# Altium schematic sheet Fri3D_2020_Power.SchDoc: Power
size A3; Date: 06/06/2022; DrawnBy: Wim Van Gool; DocumentNumber: 4; Revision: 03; SheetNumber: 4; SheetTotal: 4
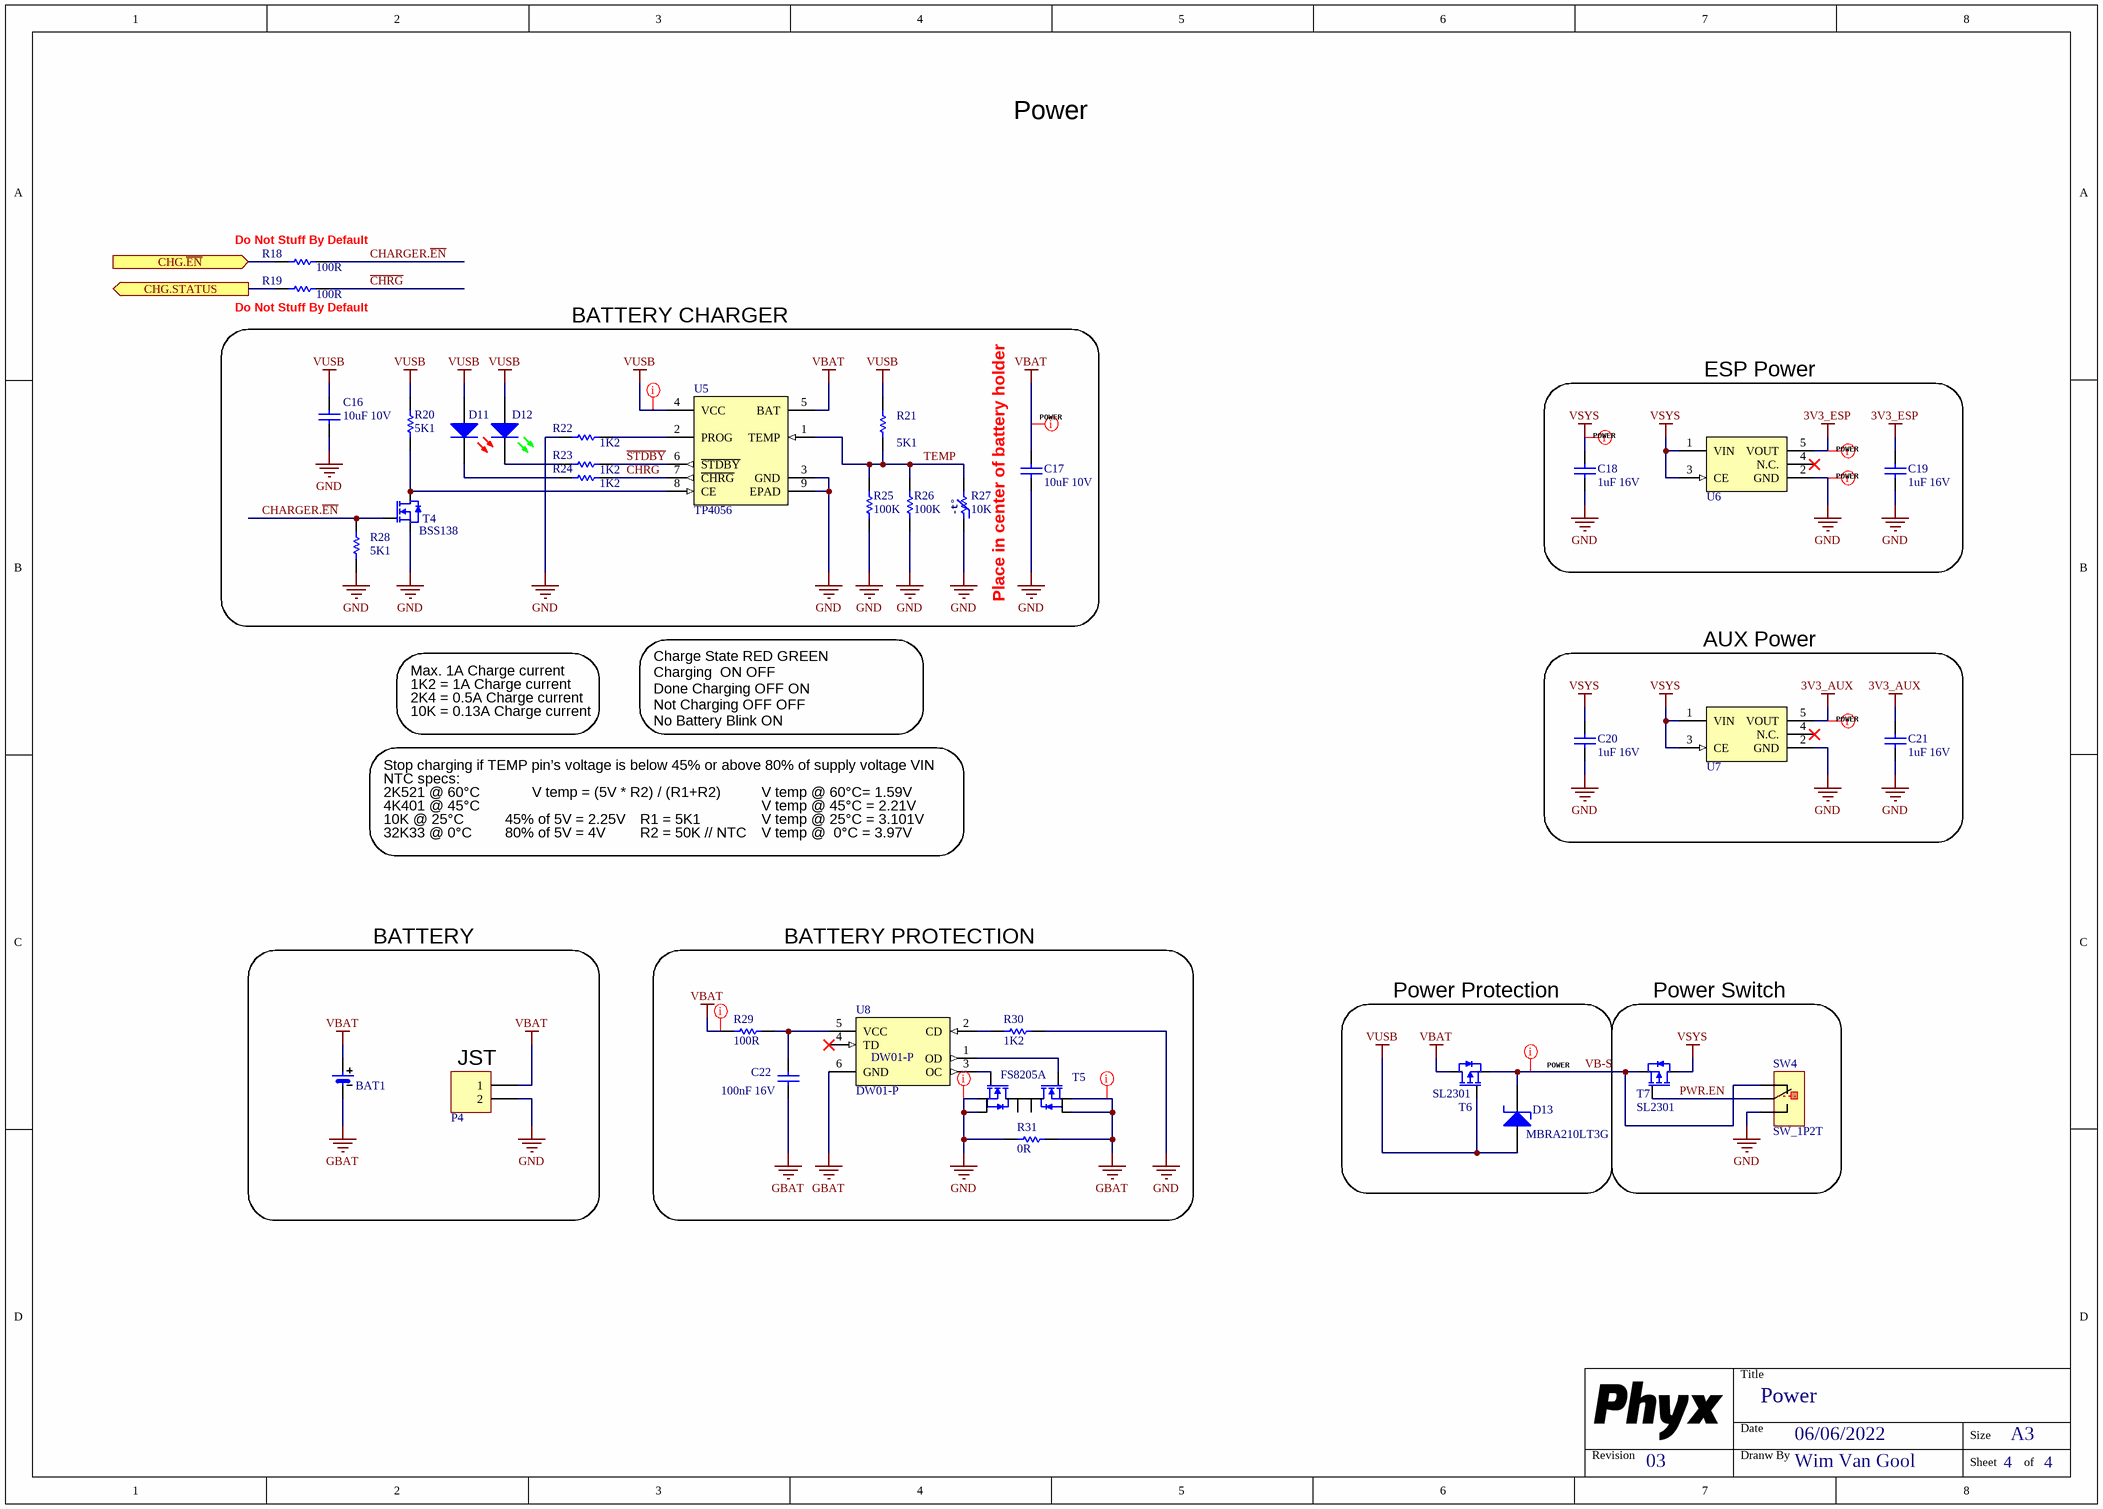
[diagram p0: Fri3D_2020_Power.SchDoc]

## Parts
BAT1  18650 Battery holder with spring  [BAT_18650_SPRING]  (value not drawn)
C16  value 10uF 10V  [C0805_N]  (hidden comment: CAP_CERAMIC)
C17  value 10uF 10V  [C0805_N]  (hidden comment: CAP_CERAMIC)
C18  value 1uF 16V  [C0603_N]  (hidden comment: CAP_CERAMIC)
C19  value 1uF 16V  [C0603_N]  (hidden comment: CAP_CERAMIC)
C20  value 1uF 16V  [C0603_N]  (hidden comment: CAP_CERAMIC)
C21  value 1uF 16V  [C0603_N]  (hidden comment: CAP_CERAMIC)
C22  value 100nF 16V  [C0603_N]
D11  Default 0805 Red LED  [LED_0805_RD]  (value not drawn)
D12  Default 0805 Green LED  [LED_0805_GR]  (value not drawn)
D13  MBRA210LT3G  [SMA_AC]
P4  Header 2.0mm Shrouded 2  [WE_620102131822]  (value not drawn)
R18  value 100R  [R0603_N]  (hidden comment: RESISTOR)
R19  value 100R  [R0603_N]  (hidden comment: RESISTOR)
R20  value 5K1  [R0603_N]  (hidden comment: RESISTOR)
R21  value 5K1  [R0603_N]  (hidden comment: RESISTOR)
R22  value 1K2  [R0603_N]  (hidden comment: RESISTOR)
R23  value 1K2  [R0603_N]  (hidden comment: RESISTOR)
R24  value 1K2  [R0603_N]  (hidden comment: RESISTOR)
R25  value 100K  [R0603_N]  (hidden comment: RESISTOR)
R26  value 100K  [R0603_N]  (hidden comment: RESISTOR)
R27  value 10K  [R0402]  (hidden comment: NTC)
R28  value 5K1  [R0603_N]  (hidden comment: RESISTOR)
R29  value 100R  [R0603_N]  (hidden comment: RESISTOR)
R30  value 1K2  [R0603_N]  (hidden comment: RESISTOR)
R31  value 0R  [R0603_N]
SW4  SW_1P2T  [WE_450404015514]
T4  value BSS138  [SOT23-3]  (hidden comment: 0.2A N-Ch MOSFET Vgs 3.2)
T5  value FS8205A  [TSSOP_8_65P]  (hidden comment: Dual N-Ch MOSFET Common Drain)
T6  value SL2301  [SOT23-3]  (hidden comment: -2.3A -20V P-Ch MOSFET Vgs -1V)
T7  value SL2301  [SOT23-3]  (hidden comment: -2.3A -20V P-Ch MOSFET Vgs -1V)
U5  value TP4056  [SOIC_N_8_TH]  (hidden comment: Single Cell LiIon charger max 1A)
U6  3V3 LDO 700mA 50mV  [SOT23-5]  (value not drawn)
U7  3V3 LDO 700mA 50mV  [SOT23-5]  (value not drawn)
U8  value DW01-P  [SOT23-6]  (hidden comment: DW01-P single cell lithium protection)

## Blocks framed on the sheet
BATTERY CHARGER: C16 C17 D11 D12 R20-R28 T4 U5
ESP Power: C18 C19 U6
AUX Power: C20 C21 U7
BATTERY PROTECTION: C22 R29-R31 T5 U8
Power Protection: D13 T6
Power Switch: SW4 T7

## Ports
CHG.STATUS (out), CHG.~{EN} (in)

## Nets
3V3_AUX: C21.1 U7.5(VOUT)
3V3_ESP: C19.1 U6.5(VOUT)
GBAT: BAT1.2 C22.2 R31.1 T5.2(S1) T5.3(S1) U8.6(GND)
GND: C16.2 C17.2 C18.2 C19.2 C20.2 C21.2 P4.2 R22.2 R25.2 R26.2 R27.2 R28.2 R30.2 R31.2 SW4.3 T4.2(S) T5.6(S2) T5.7(S2) U5.3(GND) U5.9(EPAD) U6.2(GND) U7.2(GND)
VBAT: BAT1.1 C17.1 P4.1 R29.1 T6.3(D) U5.5(BAT)
VSYS: C18.1 C20.1 T7.3(D) U6.1(VIN) U6.3(CE) U7.1(VIN) U7.3(CE)
VUSB: C16.1 D11.1(A) D12.1(A) D13.A R20.1 R21.1 T6.1(G) U5.4(VCC)
~{CHRG}: R19.2 R24.2 U5.7(~{CHRG})
CHARGER.~{EN}: R18.2 R28.1 T4.1(G)
CHG.~{EN}: R18.1 ; port CHG.~{EN}
CHG.STATUS: R19.1 ; port CHG.STATUS
PWR.EN: SW4.2 T7.1(G)
~{STDBY}: R23.2 U5.6(~{STDBY})
TEMP: R21.2 R25.1 R26.1 R27.1 U5.1(TEMP)
VB-S: D13.C SW4.1 T6.2(S) T7.2(S)
NetC22_1: C22.1 R29.2 U8.5(VCC)
NetD11_2: D11.2(K) R24.1
NetD12_2: D12.2(K) R23.1
NetR20_2: R20.2 T4.3(D) U5.8(CE)
NetR22_1: R22.1 U5.2(PROG)
NetR30_1: R30.1 U8.2(CD)
NetT5_4: T5.4(G1) U8.1(OD)
NetT5_5: T5.5(G2) U8.3(OC)

Not connected (* = marked no-connect by the designer): T5 1(D1) 8(D2); U6 4(N.C.)*; U7 4(N.C.)*; U8 4(TD)*

## Layout directives
net class POWER: 3V3_AUX, 3V3_ESP, GBAT, GND, VB-S, VBAT, VSYS, VUSB

## Notes on the sheet
- (near R18) Do Not Stuff By Default
- (near R19) Do Not Stuff By Default
- Place in center of battery holder
- 1K2 = 1A Charge current
- 2K4 = 0.5A Charge current
- Max. 1A Charge current
- 10K = 0.13A Charge current
- Charge State	RED	GREEN
  Charging		ON	OFF
  Done Charging	OFF	ON
  Not Charging	OFF	OFF
  No Battery	Blink	ON
- Stop charging if TEMP pin’s voltage is below 45% or above 80% of supply voltage VIN
- NTC specs:
- 10K @ 25°C
- 32K33 @ 0°C
- 2K521 @ 60°C
- 4K401 @ 45°C
- 45% of 5V = 2.25V
- 80% of 5V = 4V
- V temp = (5V * R2) / (R1+R2)
- R1 = 5K1
- R2 = 50K // NTC
- V temp @ 60°C= 1.59V
- V temp @ 45°C = 2.21V
- V temp @ 25°C = 3.101V
- V temp @  0°C = 3.97V
- BATTERY
- (near P4) JST
- Title
- Revision
- Date
- Dranw By
- Size
- A3
- Sheet
- of
- (in symbol NTC # 10K 0402) -t°

## Library data of the parts
BAT1 = 18650 Battery holder spring CN: =Description; Value: 18650_SPRING; Supplier 1: TaoBao; Supplier Part Number 1: 39761834568
C16 C17 = CAP # 10uF 10V 0805: Capacitor Ceramic; Supplier 1: Farnell; Supplier Part Number 1: 2320859
C18-C21 = CAP # 1uF 16V 0603: Capacitor Ceramic; Supplier 1: Farnell; Supplier Part Number 1: 2320814
C22 = CAP # 100nF 16V 0603: Capacitor Ceramic
D11 = LED # Red 0805: =Description; Supplier 1: Farnell; Supplier Part Number 1: 2099236
D12 = LED # Green 0805: =Description; Supplier 1: Farnell; Supplier Part Number 1: 2099239
D13 = Schottky # MBRA210LT3G: =Description
P4 = HDR # SHR 2.0mm 2way - 620102131822: Value: 620102131822; Supplier 1: Wurth
R18 R19 R29 = RES # 100R 0603
R20 R21 R28 = RES # 5K1 0603: Supplier 1: Farnell; Supplier Part Number 1: 2845922
R22-R24 R30 = RES # 1K2 0603
R25 R26 = RES # 100K 0603
R27 = NTC # 10K 0402: Supplier 1: LCSC; Supplier Part Number 1: C209959; Supplier 2: LCSC; Supplier Part Number 2: C98099
R31 = RES # 0R 0603: Supplier 1: Farnell; Supplier Part Number 1: 2447743
SW4 = SW # 1P2T WS-SLSU mini slide 6,7 x 2,7 mm
T4 = BSS138 N-Ch MOSFET 0.2A 3.2Vgs 60Vds: Supplier 1: Farnell; Supplier Part Number 1: 2432717
T5 = FS8205A Dual N-Ch common Drain for DW01-P: =Description; Supplier 1: AliExpress; Supplier Part Number 1: FS8205A
T6 T7 = SL2301 P-Ch MOSFET -2.3A -20Vds: =Description; Supplier 1: LCSC; Supplier Part Number 1: C181086
U5 = CHG # TP4056 LiIon 1A: =Description; Supplier 1: Aliexpress; Supplier Part Number 1: TP4056
U6 U7 = LDO # 3V3 XC6210B33: =Designator; Value: XC6210B332MR; Supplier 1: Farnell; Supplier Part Number 1: 1057803
U8 = PWR # DW01-P Lithium protection: =Description; Supplier 1: Aliexpress; Supplier Part Number 1: DW01-P